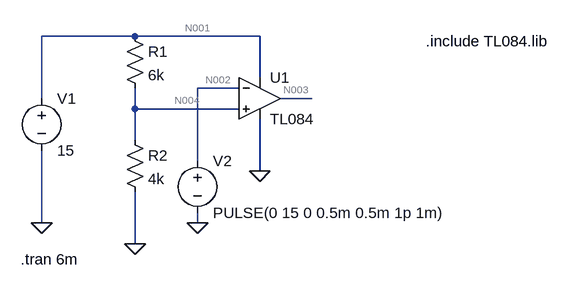
[diagram p0: schematic Comparateur.asc]
Comparateur.asc, the LTspice schematic file:
Version 4
SHEET 1 880 680
WIRE -16 0 -160 0
WIRE 176 0 -16 0
WIRE 176 64 176 0
WIRE 144 80 80 80
WIRE -160 96 -160 0
WIRE 256 96 208 96
WIRE -16 112 -16 80
WIRE 144 112 -16 112
WIRE -16 160 -16 112
WIRE 80 192 80 80
WIRE 176 208 176 128
WIRE -160 288 -160 176
WIRE 80 288 80 272
WIRE -16 320 -16 240
FLAG -16 320 0
FLAG 80 288 0
FLAG -160 288 0
FLAG 176 208 0
SYMBOL voltage -160 80 R0
WINDOW 123 0 0 Left 0
WINDOW 39 0 0 Left 0
SYMATTR InstName V1
SYMATTR Value 15
SYMBOL res -32 -16 R0
SYMATTR InstName R1
SYMATTR Value 6k
SYMBOL res -32 144 R0
SYMATTR InstName R2
SYMATTR Value 4k
SYMBOL voltage 80 176 R0
WINDOW 123 0 0 Left 0
WINDOW 39 0 0 Left 0
SYMATTR InstName V2
SYMATTR Value PULSE(0 15 0 0.5m 0.5m 1p 1m)
SYMBOL OpAmps\\opamp2 176 32 R0
SYMATTR InstName U1
SYMATTR Value TL084
TEXT -192 344 Left 2 !.tran 6m
TEXT 432 8 Left 2 !.include TL084.lib

The netlist it stands for:
* Comparateur.asc
V1 N001 0 15
R1 N001 N004 6k
R2 N004 0 4k
V2 N002 0 PULSE(0 15 0 0.5m 0.5m 1p 1m)
XU1 N004 N002 N001 0 N003 TL084  ; pins In+ In- V+ V- OUT
.tran 6m
.include TL084.lib
.backanno
.end

* Results of the author's LTspice run, read from the files saved beside the schematic
* Operating Point, zero values left out:
*   V(n001) = 15 V
*   V(n004) = 6 V
*   V(n003) = 13.45 V
*   I(R2) = 1.5 mA
*   I(R1) = 1.5 mA
*   I(V2) = 118.6 µA
*   I(V1) = -8.616 mA
*   Ix(u1:IN+) = 41.59 pA
*   Ix(u1:IN-) = -118.6 µA
*   Ix(u1:V+) = 7.116 mA
*   Ix(u1:V-) = -7.083 mA
*   Ix(u1:OUT) = 182.6 pA
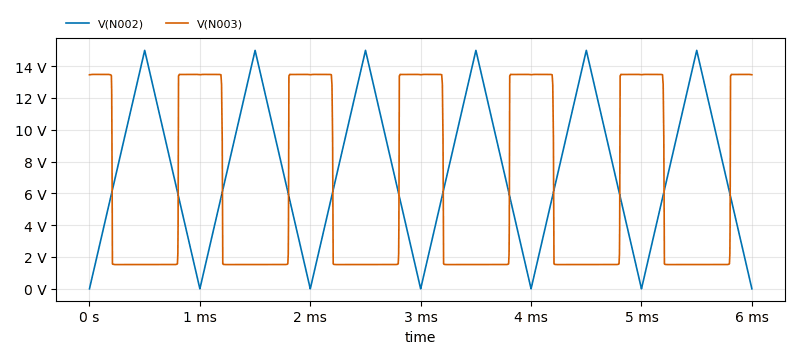
[diagram p1: Transient Analysis of Comparateur.asc, plotted from the saved traces]
* Transient Analysis, 1 run:
*   V(N002): min 0 V, max 14.99 V, average 7.498 V, rms 8.865 V, last 0 V
*   V(N003): min 1.523 V, max 13.48 V, average 6.294 V, rms 8.571 V, last 13.46 V